# Altium schematic sheet Sheet1.SchDoc
size A4; SheetNumber: 1; SheetTotal: 1
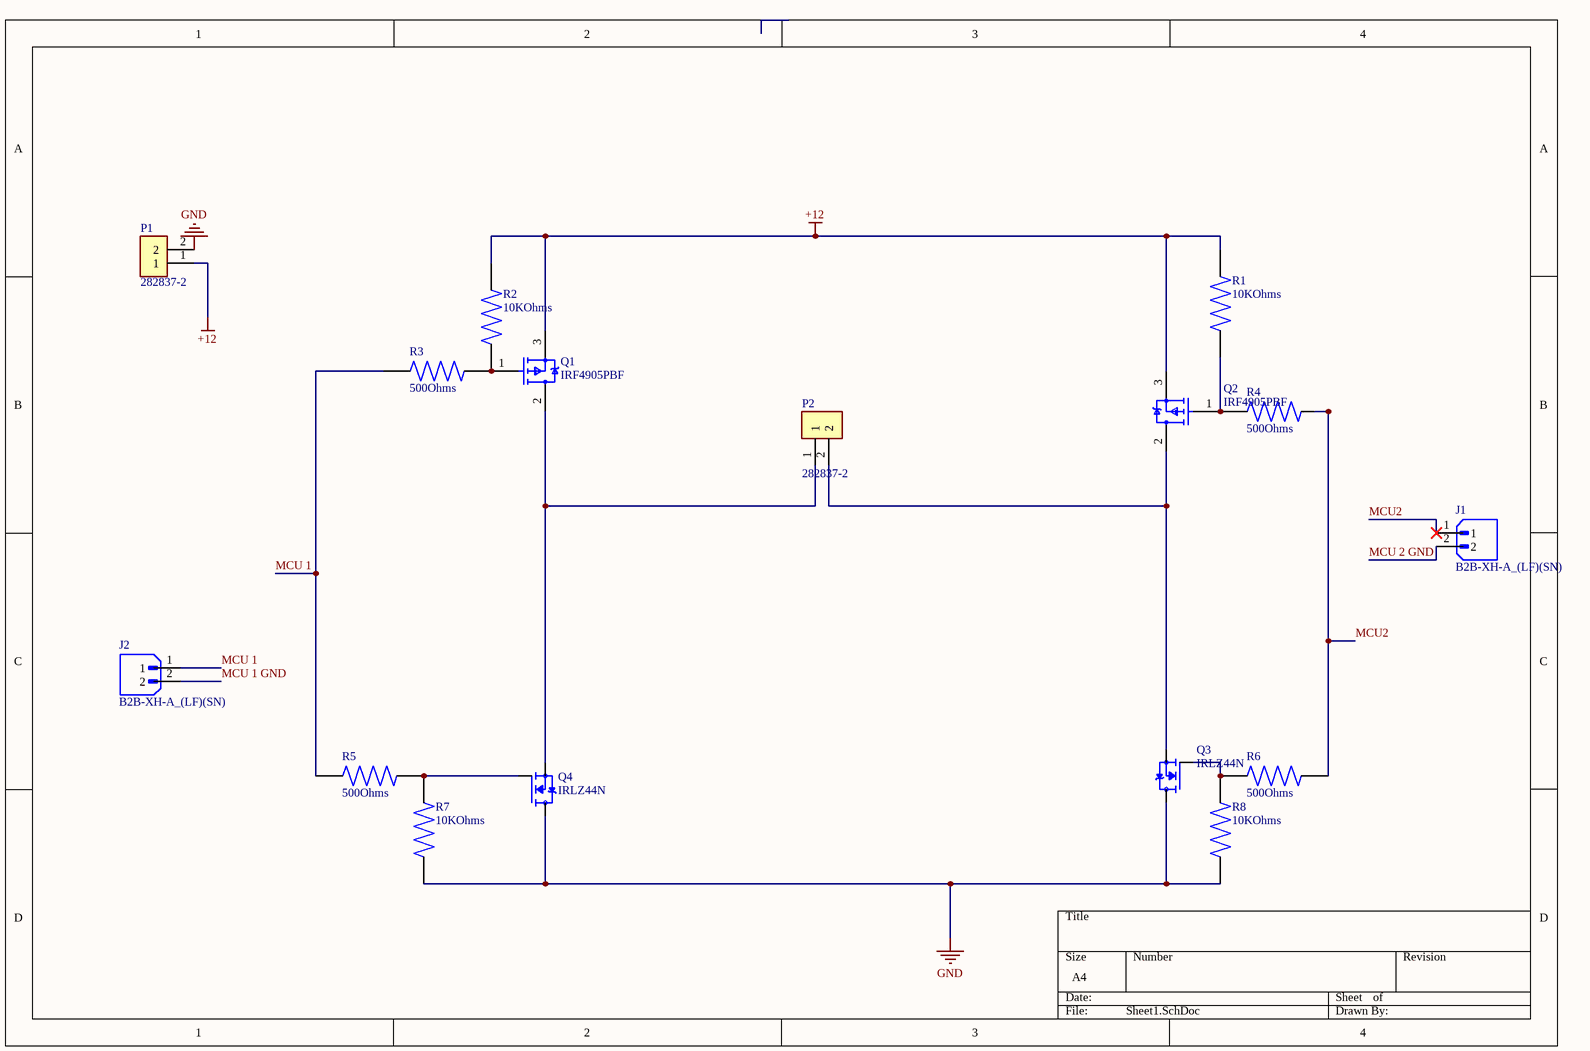
[diagram p0: Sheet1.SchDoc]

## Parts
J1  B2B-XH-A_(LF)(SN)  [JST_B2B-XH-A_(LF)(SN)]
J2  B2B-XH-A_(LF)(SN)  [JST_B2B-XH-A_(LF)(SN)]
P1  282837-2  [TE_282837-2]
P2  282837-2  [TE_282837-2]
Q1  IRF4905PBF  [FP-PG-TO220-3-MFG]
Q2  IRF4905PBF  [FP-PG-TO220-3-MFG]
Q3  IRLZ44N  [TO254P1054X469X1930-3]
Q4  IRLZ44N  [TO254P1054X469X1930-3]
R1  10KOhms  [RESAD1100W55L680D260]
R2  10KOhms  [RESAD1100W55L680D260]
R3  500Ohms  [RESAD1100W55L680D260]
R4  500Ohms  [RESAD1100W55L680D260]
R5  500Ohms  [RESAD1100W55L680D260]
R6  500Ohms  [RESAD1100W55L680D260]
R7  10KOhms  [RESAD1100W55L680D260]
R8  10KOhms  [RESAD1100W55L680D260]

## Nets
+12: P1.1 Q1.3(SOURCE) Q2.3(SOURCE) R1.1 R2.1
GND: P1.2 Q3.2(D) Q4.2(D) R7.2 R8.1
MCU2: J1.1 R4.2 R6.2
MCU 1: J2.1 R3.1 R5.1
MCU 1 GND: J2.2
MCU 2 GND: J1.2
NetP2_1: P2.1 Q1.2(DRAIN) Q4.3(S)
NetP2_2: P2.2 Q2.2(DRAIN) Q3.3(S)
NetQ1_1: Q1.1(GATE) R2.2 R3.2
NetQ2_1: Q2.1(GATE) R1.2 R4.1
NetQ3_1: Q3.1(G) R6.1 R8.2
NetQ4_1: Q4.1(G) R5.2 R7.1

## Library data of the parts
J1 J2 = B2B-XH-A_(LF)(SN): Connector Header Through Hole 2 position 0.098 (2.50mm); MF: JST Sales; MP: B2B-XH-A (LF)(SN); SnapEDA_Link: https://www.snapeda.com/parts/B2B-XH-A%20(LF)(SN)/JST+Sales+America+Inc./view-part/?ref=snap; Package: None; Value: *; Check_prices: https://www.snapeda.com/parts/B2B-XH-A%20(LF)(SN)/JST+Sales+America+Inc./view-part/?ref=eda
P1 P2 = 282837-2: Ð Ð°Ð·ÑŠÐµÐ¼Ð½Ñ‹Ðµ ÐºÐ»ÐµÐ¼Ð¼Ð½Ñ‹Ðµ ÐºÐ¾Ð»Ð¾Ð´ÐºÐ¸ Ð Ð¾Ð·ÐµÑ‚ÐºÐ° 2 Ð¿Ð¾Ð»Ð¾Ð¶ÐµÐ½Ð¸Ñ 5,08 Ð¼Ð¼ ÐŸÑ€Ð¸Ð¿Ð¾Ð¹ Ð¿Ñ€ÑÐ¼Ð¾Ð¹ Ñ‡ÐµÑ€ÐµÐ· Ð¾Ñ‚Ð²ÐµÑ€ÑÑ‚Ð¸Ðµ 13,5 Ð / ÐºÐ¾Ð½Ñ‚Ð°ÐºÑ‚; MF: TE Connectivity; SnapEDA_Link: https://www.snapeda.com/parts/282837-2/TE+Connectivity+AMP+Connectors/view-part/?ref=snap; Price: None; Check_prices: https://www.snapeda.com/parts/282837-2/TE+Connectivity+AMP+Connectors/view-part/?ref=eda; Purchase-URL: https://pricing.snapeda.com/search/part/282837-2/?ref=eda; MP: 282837-2; Value: *; Availability: In Stock; Package: None
Q1 Q2 = CMP-32901-000200-1: MOSFET P-CH 55V 74A TO-220AB; Drain to Source Resistance: 20mR; Input Capacitance: 3.4nF; Max Dual Supply Voltage: -55V; Power Dissipation: 200W; Turn-On Delay Time: 18ns; Element Configuration: Single; Threshold Voltage: -4V; Gate to Source Voltage (Vgs): 20V; Turn-Off Delay Time: 61ns; Number of Pins: 3; Packaging: Rail/Tube; RoHS Compliant: Yes; REACH SVHC: No SVHC; Halogen Free: Halogen Free; Max Power Dissipation: 200W; Drain to Source Breakdown Voltage: -55V; Length: 0.414inch; Drain to Source Voltage (Vdss): -55V; Height: 0.6inch; Case/Package: TO-220; Width: 0.185inch; Continuous Drain Current (ID): 74A; Mount: Through Hole; Min Operating Temperature: -55°C; Lead Free: Lead Free; Max Operating Temperature: 175°C; Rds On Max: 20mR
Q3 Q4 = IRLZ44N: N-Channel 55 V 47A (Tc) 3.8W (Ta), 110W (Tc) Surface Mount D2PAK; MF: Infineon / IR; Package: TO-220-3 Infineon / IR; Availability: Not in stock; Value: *; MP: IRLZ44N; Check_prices: https://www.snapeda.com/parts/IRLZ44N/Infineon/view-part/?ref=eda; Price: None; SnapEDA_Link: https://www.snapeda.com/parts/IRLZ44N/Infineon/view-part/?ref=snap
R1-R8 = MFR-25FBF52-10K: 10.2 kOhms Â±1% 0.25W, 1/4W Through Hole Resistor Axial - Metal Film; MF: Yageo; SnapEDA_Link: https://www.snapeda.com/parts/MFR-25FBF52-10K/Yageo/view-part/?ref=snap; Availability: In Stock; Price: None; Value: *; Check_prices: https://www.snapeda.com/parts/MFR-25FBF52-10K/Yageo/view-part/?ref=eda; Purchase-URL: https://pricing.snapeda.com/search/part/MFR-25FBF52-10K/?ref=eda; MP: MFR-25FBF52-10K; Package: Axial Yageo